# Altium schematic sheet 3.relayoutv4.SchDoc
size A4; DocumentNumber: 4; SheetNumber: 4; SheetTotal: 4; PageSetup: Record=PageOptions|CenterHorizontal=True|CenterVertical=True|PrintScale=1.00|XCorrection=1.00|YCorrection=1.00|PrintKind=1|BorderSize=5000000|LeftOffset=0|BottomOffset=0|Orientation=2|PaperLength=1000|PaperWidth=1000|Scale=100|PaperSource=15|PrintQuality=1200|MediaType=1|DitherType=10|PrintScaleMode=1|PaperKind=A4|PaperIndex=9
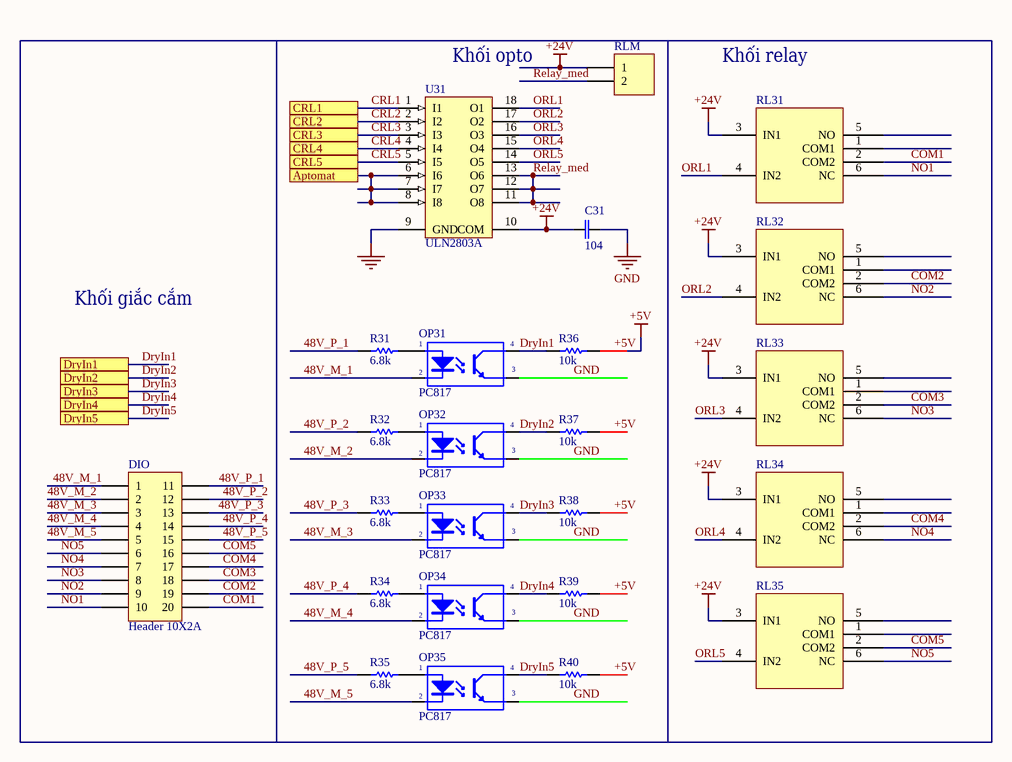
[diagram p0: 3.relayoutv4.SchDoc]

## Parts
C31  value 104  [CAP 0805]  (hidden comment: Tụ điện dán 0805104)
DIO  Header 10X2A  [HDR2X10_CEN]
OP31  PC817  [DIP4/W0.3]
OP32  PC817  [DIP4/W0.3]
OP33  PC817  [DIP4/W0.3]
OP34  PC817  [DIP4/W0.3]
OP35  PC817  [DIP4/W0.3]
R31  value 6.8k  [RESC3216N]  (hidden comment: Điện trở dán 12066.8k)
R32  value 6.8k  [RESC3216N]  (hidden comment: Điện trở dán 12066.8k)
R33  value 6.8k  [RESC3216N]  (hidden comment: Điện trở dán 12066.8k)
R34  value 6.8k  [RESC3216N]  (hidden comment: Điện trở dán 12066.8k)
R35  value 6.8k  [RESC3216N]  (hidden comment: Điện trở dán 12066.8k)
R36  value 10k  [RES 0805]  (hidden comment: Điện trở dán 080510k)
R37  value 10k  [RES 0805]  (hidden comment: Điện trở dán 080510k)
R38  value 10k  [RES 0805]  (hidden comment: Điện trở dán 080510k)
R39  value 10k  [RES 0805]  (hidden comment: Điện trở dán 080510k)
R40  value 10k  [RES 0805]  (hidden comment: Điện trở dán 080510k)
RL31  HK4100F_12V  [HK4100F]  (value not drawn)
RL32  HK4100F_12V  [HK4100F]  (value not drawn)
RL33  HK4100F_12V  [HK4100F]  (value not drawn)
RL34  HK4100F_12V  [HK4100F]  (value not drawn)
RL35  HK4100F_12V  [HK4100F]  (value not drawn)
RLM  Header 2  [HDR1X2]  (value not drawn)
U31  ULN2803A  [SOIC-18]

## Ports
Aptomat, CRL1, CRL2, CRL3, CRL4, CRL5, DryIn1, DryIn2, DryIn3, DryIn4, DryIn5

## Nets
+5V: R36.2 R37.2 R38.2 R39.2 R40.2
+24V: C31.2 RL31.3(IN1) RL32.3(IN1) RL33.3(IN1) RL34.3(IN1) RL35.3(IN1) RLM.1 U31.10(COM)
GND: C31.1 OP31.3(E) OP32.3(E) OP33.3(E) OP34.3(E) OP35.3(E) U31.9(GND)
48V_M_1: DIO.1 OP31.2(K)
48V_M_2: DIO.2 OP32.2(K)
48V_M_3: DIO.3 OP33.2(K)
48V_M_4: DIO.4 OP34.2(K)
48V_M_5: DIO.5 OP35.2(K)
48V_P_1: DIO.11 R31.1
48V_P_2: DIO.12 R32.1
48V_P_3: DIO.13 R33.1
48V_P_4: DIO.14 R34.1
48V_P_5: DIO.15 R35.1
Aptomat: U31.6(I6) U31.7(I7) U31.8(I8) ; port Aptomat
COM1: DIO.20 RL31.2(COM2)
COM2: DIO.19 RL32.2(COM2)
COM3: DIO.18 RL33.2(COM2)
COM4: DIO.17 RL34.2(COM2)
COM5: DIO.16 RL35.2(COM2)
CRL1: U31.1(I1) ; port CRL1
CRL2: U31.2(I2) ; port CRL2
CRL3: U31.3(I3) ; port CRL3
CRL4: U31.4(I4) ; port CRL4
CRL5: U31.5(I5) ; port CRL5
DryIn1: OP31.4(C) R36.1 ; port DryIn1
DryIn2: OP32.4(C) R37.1 ; port DryIn2
DryIn3: OP33.4(C) R38.1 ; port DryIn3
DryIn4: OP34.4(C) R39.1 ; port DryIn4
DryIn5: OP35.4(C) R40.1 ; port DryIn5
NO1: DIO.10 RL31.6(NC)
NO2: DIO.9 RL32.6(NC)
NO3: DIO.8 RL33.6(NC)
NO4: DIO.7 RL34.6(NC)
NO5: DIO.6 RL35.6(NC)
ORL1: RL31.4(IN2) U31.18(O1)
ORL2: RL32.4(IN2) U31.17(O2)
ORL3: RL33.4(IN2) U31.16(O3)
ORL4: RL34.4(IN2) U31.15(O4)
ORL5: RL35.4(IN2) U31.14(O5)
Relay_med: RLM.2 U31.11(O8) U31.12(O7) U31.13(O6)
NetOP31_1: OP31.1(A) R31.2
NetOP32_1: OP32.1(A) R32.2
NetOP33_1: OP33.1(A) R33.2
NetOP34_1: OP34.1(A) R34.2
NetOP35_1: OP35.1(A) R35.2

Not connected (* = marked no-connect by the designer): RL31 1(COM1) 5(NO); RL32 1(COM1) 5(NO); RL33 1(COM1) 5(NO); RL34 1(COM1) 5(NO); RL35 1(COM1) 5(NO)

## Notes on the sheet
- (near U31) Khối opto
- Khối relay
- Khối giắc cắm

## Library data of the parts
C31 = CAP NP: Capacitor non polarized; cm1: Tụ điện dán 0603; cm3: Tụ điện dán 1206; cm2: Tụ điện dán 0805
DIO = Header 10X2A: Header, 10-Pin, Dual row; LatestRevisionDate: 17-Jul-2002; LatestRevisionNote: Re-released for DXP Platform.; Publisher: Altium Limited
OP31-OP35 = PC817: Single Opto; Value: PC817
R31-R35 = Res: Resistor; cm1: Điện trở dán 0603; cm2: Điện trở cắm 1/4W; cm3: Điện trở dán 0805; cm4: Điện trở dán 1206
R36-R40 = Res: Resistor; cm1: Điện trở dán 0603; cm2: Điện trở cắm 1/4W; cm4: Điện trở dán 1206; cm3: Điện trở dán 0805
RL31-RL35 = HK4100F
RLM = Header 2: Header, 2-Pin; LatestRevisionDate: 17-Jul-2002; LatestRevisionNote: Re-released for DXP Platform.; Publisher: Altium Limited
U31 = ULN2803A: High-Voltage, High-Current Darlington Array; LatestRevisionNote: Stylized 3D Model Added.; Publisher: Altium Limited; Value: ULN2803A